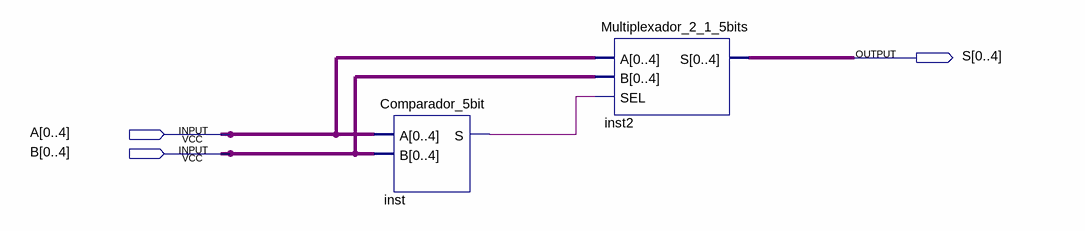
[diagram p0: schematic sheet]
// Quartus schematic Maximo.bdf as structural Verilog: 2 symbols, 3 pins
module Maximo (
  input  [0:4] A,
  input  [0:4] B,
  output [0:4] S
);

  wire inst_s;

  Comparador_5bit inst (.A(A), .B(B), .S(inst_s));
  Multiplexador_2_1_5bits inst2 (.A(A), .B(B), .SEL(inst_s), .S(S));
endmodule
